# EAGLE design STLink.v21 (EAGLE 7.2.0)
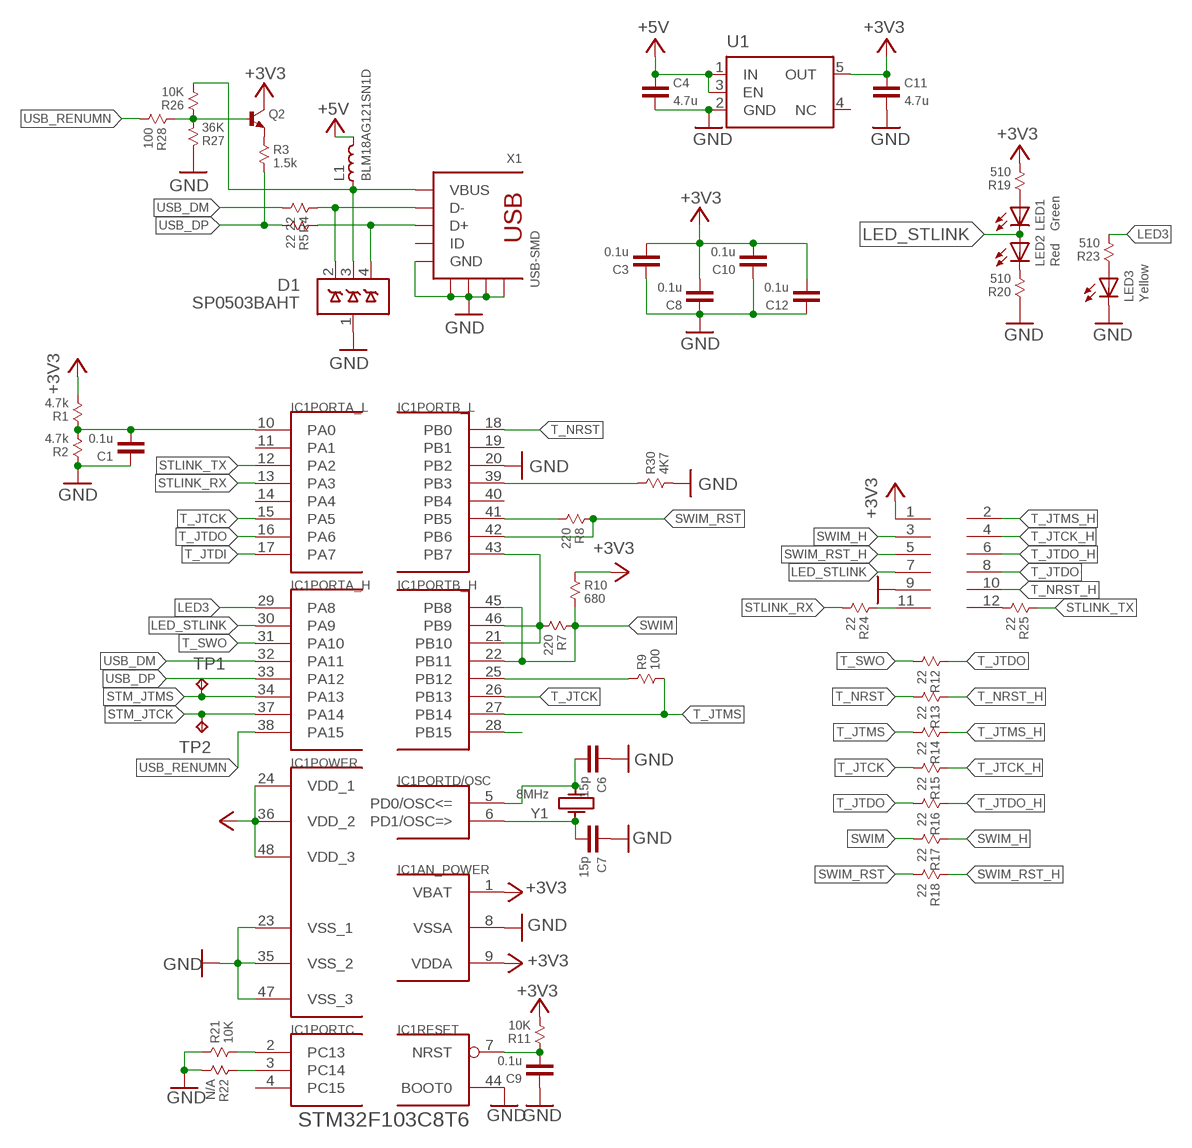
[diagram p0: schematic, sheet 1]

## Parts
C1  0.1u  CAP-0603  [0603]
C3  0.1u  CAP-0603  [0603]
C4  4.7u  CAP-0603  [0603]
C6  15p  CAP-0603  [0603]
C7  15p  CAP-0603  [0603]
C8  0.1u  CAP-0603  [0603]
C9  0.1u  CAP-0603  [0603]
C10  0.1u  CAP-0603  [0603]
C11  4.7u  CAP-0603  [0603]
C12  0.1u  CAP-0603  [0603]
CN2  M06X2  [PLANAR-6X2]
D1  SP0503BAHT  [SOT143]
IC1  STM32F103C8T6  STM32F10XCXT6  [TQFP48]
L1  BLM18AG121SN1D  INDUCTOR-0603  [0603]
LED1  Green  LEDCHIP-LED0603  [CHIP-LED0603]
LED2  Red  LEDCHIP-LED0603  [CHIP-LED0603]
LED3  Yellow  LEDCHIP-LED0603  [CHIP-LED0603]
Q2  NPNBC847  [SOT-23]
R1  4.7k  RESISTOR-0603  [0603]
R2  4.7k  RESISTOR-0603  [0603]
R3  1.5k  RESISTOR-0603  [0603]
R4  22  RESISTOR-0603  [0603]
R5  22  RESISTOR-0603  [0603]
R7  220  RESISTOR-0603  [0603]
R8  220  RESISTOR-0603  [0603]
R9  100  RESISTOR-0603  [0603]
R10  680  RESISTOR-0603  [0603]
R11  10K  RESISTOR-0603  [0603]
R12  22  RESISTOR-0603  [0603]
R13  22  RESISTOR-0603  [0603]
R14  22  RESISTOR-0603  [0603]
R15  22  RESISTOR-0603  [0603]
R16  22  RESISTOR-0603  [0603]
R17  22  RESISTOR-0603  [0603]
R18  22  RESISTOR-0603  [0603]
R19  510  RESISTOR-0603  [0603]
R20  510  RESISTOR-0603  [0603]
R21  10K  RESISTOR-0603  [0603]
R22  N/A  RESISTOR-0603  [0603]
R23  510  RESISTOR-0603  [0603]
R24  22  RESISTOR-0603  [0603]
R25  22  RESISTOR-0603  [0603]
R26  10K  RESISTOR-0603  [0603]
R27  36K  RESISTOR-0603  [0603]
R28  100  RESISTOR-0603  [0603]
R30  4K7  RESISTOR-0603  [0603]
TP1  TPTP10R  [TP10R]
TP2  TPTP10R  [TP10R]
U1  TPS73033  [SOT23-5]
X1  USB-SMD  [USB-MINIB]
Y1  8MHz  CRYSTAL-0532  [C0532]

## Nets
+3V3: C3.1 C8.1 C10.1 C11.2 C12.1 CN2.1 IC1.1(AN_POWER:VBAT) IC1.9(AN_POWER:VDDA) IC1.24(POWER:VDD_1) IC1.36(POWER:VDD_2) IC1.48(POWER:VDD_3) Q2.3(C) R1.2 R10.1 R11.2 R19.2 U1.5(OUT)
+5V: C4.2 L1.2 U1.1(IN) U1.3(EN)
AIN1: C1.1 IC1.10(PORTA_L:PA0) R1.1 R2.2
GND: C1.2 C3.2 C4.1 C6.2 C7.2 C8.2 C9.2 C10.2 C11.1 C12.2 CN2.9 D1.1(GND) IC1.8(AN_POWER:VSSA) IC1.20(PORTB_L:PB2) IC1.23(POWER:VSS_1) IC1.35(POWER:VSS_2) IC1.44(RESET:BOOT0) IC1.47(POWER:VSS_3) LED3.C R2.1 R20.1 R21.1 R22.2 R27.1 R30.2 U1.2(GND) X1.GND X1.GND@1(GND) X1.GND@2(GND) X1.GND@3(GND) X1.GND@4(GND)
LED3: IC1.29(PORTA_H:PA8) R23.2
LED_STLINK: CN2.7 IC1.30(PORTA_H:PA9) LED1.C LED2.A
N$1: C6.1 IC1.5(PORTD/OSC:PD0/OSC<=) Y1.3
N$2: C7.1 IC1.6(PORTD/OSC:PD1/OSC=>) Y1.1
N$3: C9.1 IC1.7(RESET:NRST) R11.1
N$4: IC1.39(PORTB_L:PB3) R30.1
N$5: D1.2(D1) R4.1 X1.D-
N$6: D1.4(D3) R5.1 X1.D+
N$7: LED2.C R20.2
N$8: LED1.A R19.1
N$9: D1.3(D2) L1.1 R26.2 X1.VBUS
N$10: CN2.11 R24.1
N$11: CN2.12 R25.2
N$12: LED3.A R23.1
N$13: Q2.2(E) R3.1
N$14: IC1.28(PORTB_H:PB15)
N$15: IC1.2(PORTC:PC13) R21.2
N$16: IC1.3(PORTC:PC14) R22.1
N$17: Q2.1(B) R26.1 R27.2 R28.1
STLINK_RX: IC1.13(PORTA_L:PA3) R24.2
STLINK_TX: IC1.12(PORTA_L:PA2) R25.1
STM_JTCK: IC1.37(PORTA_H:PA14) TP2.TP
STM_JTMS: IC1.34(PORTA_H:PA13) TP1.TP
SWIM: IC1.22(PORTB_H:PB11) IC1.45(PORTB_H:PB8) R7.1 R10.2 R17.2
SWIM_H: CN2.3 R17.1
SWIM_IN: IC1.21(PORTB_H:PB10) IC1.43(PORTB_L:PB7) IC1.46(PORTB_H:PB9) R7.2
SWIM_RST: IC1.42(PORTB_L:PB6) R8.1 R18.2
SWIM_RST_H: CN2.5 R18.1
SWIM_RST_IN: IC1.41(PORTB_L:PB5) R8.2
T_JTCK: IC1.15(PORTA_L:PA5) IC1.26(PORTB_H:PB13) R15.2
T_JTCK_H: CN2.4 R15.1
T_JTDI: IC1.17(PORTA_L:PA7)
T_JTDO: CN2.8 IC1.16(PORTA_L:PA6) R12.1 R16.2
T_JTDO_H: CN2.6 R16.1
T_JTMS: IC1.27(PORTB_H:PB14) R9.2 R14.2
T_JTMS_H: CN2.2 R14.1
T_NRST: IC1.18(PORTB_L:PB0) R13.2
T_NRST_H: CN2.10 R13.1
T_SWDIO_IN: IC1.25(PORTB_H:PB12) R9.1
T_SWO: IC1.31(PORTA_H:PA10) R12.2
USB_DM: IC1.32(PORTA_H:PA11) R4.2
USB_DP: IC1.33(PORTA_H:PA12) R3.2 R5.2
USB_RENUMN: IC1.38(PORTA_H:PA15) R28.2
Unconnected: IC1.4(PORTC:PC15) IC1.11(PORTA_L:PA1) IC1.14(PORTA_L:PA4) IC1.19(PORTB_L:PB1) IC1.40(PORTB_L:PB4) U1.4(NC) X1.ID

## Library data of the parts
C1 C3 C4 C6-C12 = X893:CAP: Capacitor
CN2 = X893:M06X2
D1 = X893:SP0503BAHT: Surface Mount TVS Avalanche Diode Array (5V) http://www.littelfuse.com/data/en/Data_Sheets/SP05xxBA.pdf
IC1 = stm32:STM32F10XCXT6: ST STM32F101/103 48pin LQFP
L1 = X893:INDUCTOR: http://www.murata.com/products/catalog/pdf/o05e.pdf
LED1-LED3 = led:LED: LED OSRAM: - CHIPLED LG R971, LG N971, LY N971, LG Q971, LY Q971, LO R971, LY R971 LH N974, LH R974 LS Q976, LO Q976, LY Q976 LO Q996 - Hyper CHIPLED LW Q18S LB Q993, LB Q99A, LB R99A - SideLED LS A670, LO A670, LY A670, LG A670, LP A670 LB A673, LV A673, LT A673, LW A673 LH A674 LY A675 LS A676, LA A676, LO A676, LY A676, LW A676 LS A679, LY A679, LG A679 - Hyper Micro SIDELED® LS Y876, LA Y876, LO Y876, LY Y876 LT Y87S - SmartLED LW L88C, LW L88S LB L89C, LB L89S, LG L890 LS L89K, LO L89K, LY L89K LS L896, LA L896, LO L896, LY L896 - TOPLED LS T670, LO T670, LY T670, LG T670, LP T670 LSG T670, LSP T670, LSY T670, LOP T670, LYG T670 LG T671, LOG T671, LSG T671 LB T673, LV T673, LT T673, LW T673 LH T674 LS T676, LA T676, LO T676, LY T676, LB T676, LH T676, LSB T676, LW T676 LB T67C, LV T67C, LT T67C, LS T67K, LO T67K, LY T67K, LW E67C LS E67B, LA E67B, LO E67B, LY E67B, LB E67C, LV E67C, LT E67C LW T67C LS T679, LY T679, LG T679 LS T770, LO T770, LY T770, LG T770, LP T770 LB T773, LV T773, LT T773, LW T773 LH T774 LS E675, LA E675, LY E675, LS T675 LS T776, LA T776, LO T776, LY T776, LB T776 LHGB T686 LT T68C, LB T68C - Hyper Mini TOPLED® LB M676 - Mini TOPLED Santana® LG M470 LS M47K, LO M47K, LY M47K Source: http://www.osram.convergy.de LUXEON: - LUMILED® LXK2-PW12-R00, LXK2-PW12-S00, LXK2-PW14-U00, LXK2-PW14-V00 LXK2-PM12-R00, LXK2-PM12-S00, LXK2-PM14-U00 LXK2-PE12-Q00, LXK2-PE12-R00, LXK2-PE12-S00, LXK2-PE14-T00, LXK2-PE14-U00 LXK2-PB12-K00, LXK2-PB12-L00, LXK2-PB12-M00, LXK2-PB14-N00, LXK2-PB14-P00, LXK2-PB14-Q00 LXK2-PR12-L00, LXK2-PR12-M00, LXK2-PR14-Q00, LXK2-PR14-R00 LXK2-PD12-Q00, LXK2-PD12-R00, LXK2-PD12-S00 LXK2-PH12-R00, LXK2-PH12-S00 LXK2-PL12-P00, LXK2-PL12-Q00, LXK2-PL12-R00 Source: www.luxeon.com KINGBRIGHT: KA-3528ASYC Source: www.kingbright.com
Q2 = X893:NPN
R1-R5 R7-R28 R30 = X893:RESISTOR
TP1 TP2 = testpad:TP: Test pad
U1 = X893:TPS73033: LOW-NOISE, HIGH PSRR, RF 200-mA LOW-DROPOUT LINEAR REGULATOR http://www.terraelectronica.ru/pdf/TI/TPS73033.pdf
X1 = X893:USB: USB Connectors USB-B-PTH is fully proven SKU : PRT-00139 USB-miniB is fully proven SKU : PRT-00587 USB-A-PCB is untested. USB-A-H is throughly reviewed, but untested. Spark Fun Electronics SKU : PRT-00437 USB-B-SMT is throughly reviewed, but untested. Needs silkscreen touching up. USB-A-S has not been used/tested USB-MB-H has not been used/tested
Y1 = X893:CRYSTAL: KX-9A <http://www.kosmodrom.com.ua/pdf/KX-9A.pdf> KX-KT <http://www.kosmodrom.com.ua/pdf/KX-K.pdf>

## Board
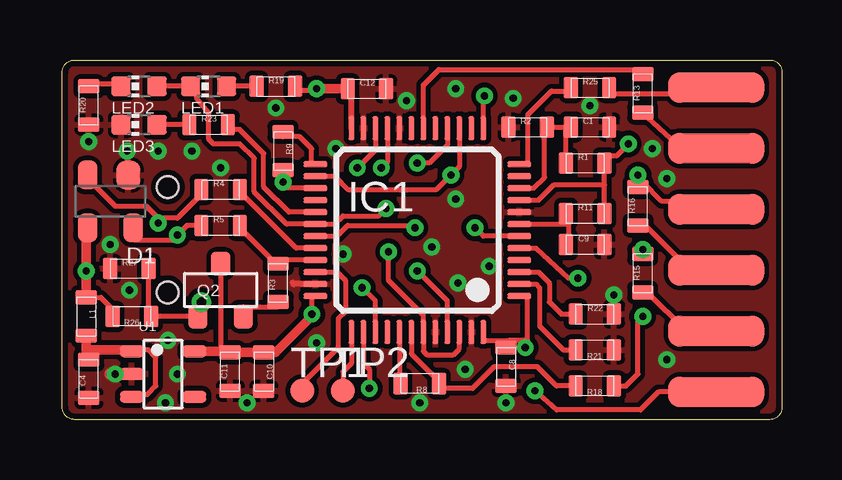
[diagram p1: board, top side]
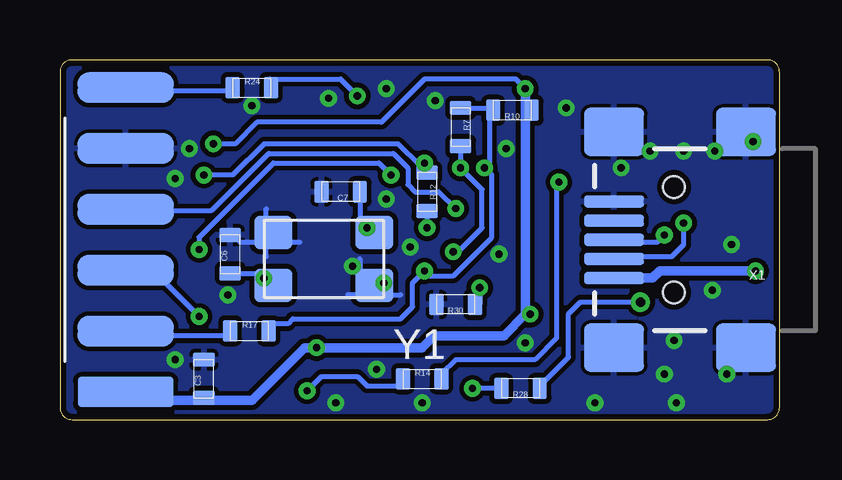
[diagram p2: board, bottom side, seen from below]

Size 30 x 15 mm. Coordinates in mm from the lower left corner, seen from the top.
Outline: 0,0.5 0,14.5 arc-90 0.5,15 29.5,15 arc-90 30,14.5 30,0.5 arc-90 29.5,0 0.5,0 arc-90 0,0.5
Copper layers (1+16): Top 0.018mm / dielectric 0.8mm / Bottom 0.018mm
Design rules "Rezonit-020-015": minimum track width 0.15mm, minimum drill 0.3mm, track to track 0.15mm, track to pad 0.2mm, pad to pad 0.2mm, via to via 0.2mm, smd to smd 0mil, copper to edge 0.25mm, drill to drill 0.3mm, minimum pad ring 0.2mm, minimum via ring 0.2mm, stop-mask expansion 4mil, vias tented up to drill 0.4mm, thermal gap 0.15mm

### Footprints (pad centres in the part's own frame; a part is rotated, then mirrored left to right if it is on the bottom)
0603 = smd 0.6 x 0.9: 1 -0.8,0; 2 0.8,0
PLANAR-6X2 = smd 1.27 x 4: 1 6.35,2.54; 3 3.81,2.54; 5 1.27,2.54; 7 -1.27,2.54; 9 -3.81,2.54; 11 -6.35,2.54 | smd 1.27 x 4 bottom: 2 6.35,2.54; 4 3.81,2.54; 6 1.27,2.54; 8 -1.27,2.54; 10 -3.81,2.54; 12 -6.35,2.54
SOT143 = smd 1 x 1.2: 1 -0.75,-1.1 | smd 0.8 x 1.2: 2 0.95,-1.1; 3 0.95,1.1; 4 -0.95,1.1
TQFP48 = smd 0.25 x 1: 1 -2.75,-4.25; 2 -2.25,-4.25; 3 -1.75,-4.25; 4 -1.25,-4.25; 5 -0.75,-4.25; 6 -0.25,-4.25; 7 0.25,-4.25; 8 0.75,-4.25; 9 1.25,-4.25; 10 1.75,-4.25; 11 2.25,-4.25; 12 2.75,-4.25; 25 2.75,4.25; 26 2.25,4.25; 27 1.75,4.25; 28 1.25,4.25; 29 0.75,4.25; 30 0.25,4.25; 31 -0.25,4.25; 32 -0.75,4.25; 33 -1.25,4.25; 34 -1.75,4.25; 35 -2.25,4.25; 36 -2.75,4.25 | smd 1 x 0.25: 13 4.25,-2.75; 14 4.25,-2.25; 15 4.25,-1.75; 16 4.25,-1.25; 17 4.25,-0.75; 18 4.25,-0.25; 19 4.25,0.25; 20 4.25,0.75; 21 4.25,1.25; 22 4.25,1.75; 23 4.25,2.25; 24 4.25,2.75; 37 -4.25,2.75; 38 -4.25,2.25; 39 -4.25,1.75; 40 -4.25,1.25; 41 -4.25,0.75; 42 -4.25,0.25; 43 -4.25,-0.25; 44 -4.25,-0.75; 45 -4.25,-1.25; 46 -4.25,-1.75; 47 -4.25,-2.25; 48 -4.25,-2.75
CHIP-LED0603 = smd 0.8 x 0.8: A 0,-0.75; C 0,0.75
SOT-23 = smd 0.8 x 1: 1 -0.95,-1.1; 2 0.95,-1.1; 3 0,1.1
TP10R = smd 1 x 1: TP 0,0
SOT23-5 = smd 0.5 x 1: 1 -0.95,-1.3; 2 0,-1.3; 3 0.95,-1.3; 4 0.95,1.3; 5 -0.95,1.3
USB-MINIB = smd 2.5 x 0.5: D+ 2.5,0; D- 2.5,0.8; GND 2.5,-1.6; ID 2.5,-0.8; VBUS 2.5,1.6 | smd 2.5 x 2: GND@1 -3,-4.5; GND@2 -3,4.5; GND@3 2.5,4.5; GND@4 2.5,-4.5 | hole 0.9: 0,2.2; 0,-2.2
C0532 = smd 1.6 x 1.4: 1 -2.1,-1.1; 2 2.1,-1.1; 3 2.1,1.1; 4 -2.1,1.1

### Placement (x,y rotation side)
C1  22,12.2 0 top
C3  24,1.7 90 bottom
C4  1.1,1.7 90 top
C6  22.9,6.9 90 bottom
C7  18.3,9.5 180 bottom
C8  18.5,2.2 270 top
C9  21.8,7.3 0 top
C10  8.4,2 270 top
C11  7,2 90 top
C12  12.7,13.8 0 top
CN2  29.8,7.5 270 bottom
D1  2,9.1 180 top
IC1  14.8,7.9 90 top
L1  1,4.3 270 top
LED1  6.1,13.9 90 top
LED2  3.2,13.9 90 top
LED3  3.2,12.3 90 top
Q2  6.6,5.4 0 top
R1  21.8,10.7 0 top
R2  19.4,12.2 0 top
R3  9,5.7 90 top
R4  6.6,9.6 0 top
R5  6.6,8.1 0 top
R7  13.3,12.2 270 bottom
R8  14.9,1.5 180 top
R9  9.2,11.2 270 top
R10  11.14,12.9 180 bottom
R11  21.8,8.6 0 top
R12  14.7,9.5 270 bottom
R13  24.2,13.6 90 top
R14  14.9,1.7 0 bottom
R15  24.2,6.1 90 top
R16  24,8.9 90 top
R17  22.1,3.7 0 bottom
R18  22.2,1.4 180 top
R19  8.9,13.9 0 top
R20  1.1,13.1 90 top
R21  22.2,2.9 180 top
R22  22.2,4.4 0 top
R23  6.1,12.3 0 top
R24  22,13.85 0 bottom
R25  22,13.85 0 top
R26  2.9,4.3 180 top
R27  2.8,6.3 0 top
R28  10.8,1.3 180 bottom
R30  13.5,4.8 180 bottom
TP1  10,1.2 0 top
TP2  11.7,1.2 0 top
U1  4.2,1.9 270 top
X1  4.4,7.5 180 bottom
Y1  19,6.7 180 bottom

### Tracks (layer width: path | path; a pad name or v marks a point on that pad's centre or on a via)
+3V3  (via drill 0.3)
  Top 0.2: 22.6,8.5 R11.2 22.6,9.8 | 19.3,3.3 19.4,3.3 19.4,5.15 IC1.1 | IC1.48 17.55,3.3 18.6,3.3 | v19.3,3 19.3,3.3 | 19.3,3.3 18.6,3.3 | 18.6,3.3 C8.1 | IC1.9 19.85,9.15 20.5,9.8 22.6,9.8 | 12.05,11.9 IC1.24 | 10.6,5.15 IC1.36 10.4,5.15 v10.4,4.4 | 22.6,9.8 R1.2 | 22.6,10.75 R1.2 | R19.2 9.6,13.75 10.59,13.75 v10.6,13.8 | Q2.3 6.6,2.9 6.65,2.85 | v23.6,11.5 23.1,11 22.6,11 R1.2
  Top 0.25: IC1.24 12.05,13.5 C12.1
  Top 0.4: U1.5 6.65,2.85 6.8,2.85 6.8,2.9 C11.2 C10.1 8.9,2.8 10.4,4.3 v10.4,4.4 | C12.1 v10.6,13.8
  Bottom 0.2: R10.1 10.6,12.9 10.6,13.3 | v10.6,13.8 11,14.2 14.8,14.2 16.6,12.4 21.8,12.4 22.7,11.5 v23.6,11.5
  Bottom 0.4: 10.6,4.4 11.5,3.5 14.4,3.5 14.9,3 v19.3,3 19.8,3 22,0.8 24,0.8 | 10.6,4.4 v10.4,4.4 | CN2.1 26.05,1.15 25.8,0.9 25.8,0.8 24,0.8 | C3.1 24,0.8 | 10.6,4.4 10.6,13.3 v10.6,13.8
+5V
  Top 0.2: U1.3 2.9,1 2.95,1.05 3.55,1.05 3.9,1.4 3.9,2.6 3.6,2.9 3.05,2.9 U1.1
  Top 0.4: L1.2 1,2.9 | 1,2.9 1,2.5 C4.2 | U1.1 2.95,2.85 2.9,2.9 1,2.9
AIN1
  Top 0.2: IC1.10 19.65,9.65 20.1,10.1 20.1,12.15 | 20.1,12.15 R2.2 | R1.1 21,12.2 | 20.1,12.15 20.25,12.15 R2.2 | R2.2 21,12.2 | 21,12.2 C1.1
GND  (via drill 0.3)
  Top 0.25: IC1.35 9.65,5.65 9.6,5.7
  Top 0.5: 2,1.9 2.6,1.9
  Bottom 0.2: 17.5,6.7 17.5,5.2 | 17.5,5.2 15.8,5.2 | 17.5,5.2 18,5.2 | 21.4,6.8 21.4,8.8 | 22.5,7.4 20,7.4
  other vias: 25.2,2.5 11.7,6.9 24.6,11.3 2.7,11.2 2.8,5.4 16.4,9.2 18.5,0.7 16.5,5.7 18.8,13.4 14.35,13.3 16.8,2.1 23,5.2 25.2,10.05 2.2,1.9 7.7,0.7 1.1,11.6 10.6,3.2 4.8,1.9 5.4,11.2 8.9,13 17.8,6.4 15.4,7.2 11.4,11.3 4,11.2 6.6,10.5 2,7.3 14.9,0.7 4.3,0.7 4.4,3.3 16.4,13.8 22,13.1
  pour Top (isolate 0.2): 0.2,0.2 0.2,14.8 29.8,14.8 29.8,0.2
  pour Bottom (isolate 0.2): 0.2,0.2 0.2,14.8 29.8,14.8 29.8,0.2
LED3
  Top 0.2: IC1.29 9.45,8.65 8.4,9.7 8.4,11.1 7.4,12.1 6.95,12.1 R23.2
LED_STLINK  (via drill 0.3)
  Top 0.2: v13.5,8.8 13.2,8.5 11.7,8.5 11.35,8.15 IC1.30 9.35,8.15 8,9.5 8,10.9 7.4,11.5 6.3,11.5 6.1,11.7 6.1,12.8 5.6,13.4 5.6,13.9 LED1.C LED2.A
  Bottom 0.2: v13.5,8.8 14.2,9.5 15.2,9.5 15.5,9.8 15.5,10.5 16.1,11.1 21.3,11.1 23.7,8.7 25.6,8.7 25.67,8.77 CN2.7
N$1  (via drill 0.3)
  Top 0.2: IC1.5 19.75,7.15 21.1,5.9 v21.5,5.9
  Bottom 0.2: C6.1 21.6,6.1 Y1.3 v21.5,5.9
N$2  (via drill 0.3)
  Top 0.2: IC1.6 17.55,7.65 v17.2,8
  Bottom 0.2: v17.2,8 Y1.1 17.5,8 C7.1
N$3
  Top 0.2: IC1.7 21.1,8.15 | 21.1,8.4 R11.1 21.1,8.15 | 21.1,8.15 21.1,7.05 C9.1
N$4  (via drill 0.3)
  Top 0.2: IC1.39 13.05,4.95 v12.5,5.5
  Bottom 0.2: v12.5,5.5 12.5,4.8 R30.1
N$5  (via drill 0.3)
  Top 0.2: R4.1 5.8,9.4 4.8,8.4 4.2,8.4 v4,8.2 4,8.4 3.5,8.9 2.2,8.9 1.05,10.05 D1.2
  Bottom 0.2: X1.D- 6.9,6.8 4.5,6.8 4,7.3 v4,8.2
N$6  (via drill 0.3)
  Top 0.2: R5.1 5.2,8.1 v4.8,7.7 4.6,7.5 3,7.5 2.85,7.65 D1.4
  Bottom 0.2: X1.D+ 6.9,7.4 5.1,7.4 v4.8,7.7
N$7
  Top 0.2: LED2.C 2.4,14 1.1,14 R20.2
N$8
  Top 0.2: R19.1 LED1.A
N$9  (via drill 0.3)
  Top 0.2: L1.1 1.6,5.1 2.2,4.5 2.2,4.35 R26.2
  Top 0.4: D1.3 1.05,7.95 1,7.9 v1,6.2 L1.1
  Bottom 0.4: X1.VBUS 5.3,5.9 5,6.2 v1,6.2
N$10
  Bottom 0.2: 22.6,13.7 R24.1 22.8,13.7 27.11,13.7 CN2.11
N$11
  Top 0.2: R25.2 22.8,13.6 25.7,13.6 25.75,13.85 CN2.12
N$12
  Top 0.2: R23.1 LED3.A
N$13
  Top 0.2: Q2.2 7.55,4.7 9,4.7 R3.1
N$15
  Top 0.2: IC1.2 19.75,5.65 19.9,5.5 19.9,3.9 20.9,2.9 R21.2
N$16
  Top 0.2: IC1.3 19.85,6.15 20.3,5.7 20.3,4.9 20.8,4.4 R22.1
N$17  (via drill 0.4)
  Top 0.2: Q2.1 5.75,4.35 | 5.75,4.35 5.7,4.3 R26.1 3.6,4.3 R27.2 | 5.75,4.35 5.75,4.85 v5.8,4.9
  Bottom 0.2: v5.8,4.9 8.3,4.9 8.8,4.4 8.8,2.6 9.9,1.5 9.9,1.3 R28.1
STLINK_RX  (via drill 0.3)
  Top 0.2: IC1.13 17.55,13.45 v17.6,13.5
  Bottom 0.2: v17.6,13.5 18.3,14.2 21.25,14.2 21.25,13.65 R24.2
STLINK_TX
  Top 0.2: IC1.12 19.4,10.65 19.4,12.7 20.4,13.7 21.2,13.7 R25.1
STM_JTCK
  Top 0.2: IC1.37 12.05,2.35 11.7,2 TP2.TP
STM_JTMS
  Top 0.2: IC1.34 11.45,6.15 11.8,5.8 11.8,4.5 11.5,4.2 11.5,3 10,1.5 TP1.TP
SWIM  (via drill 0.3)
  Top 0.2: IC1.22 13.05,11.25 v12.3,10.5 | IC1.45 16.05,4.95 v14.8,6.2
  Bottom 0.2: R17.2 21.3,4 20.5,4 20.3,4.2 15.8,4.2 15.3,4.7 15.3,5.7 v14.8,6.2 14.8,6 13.6,6 12,7.6 12,10.2 v12.3,10.5 12.1,10.7 12.1,12.9 R10.2 12.14,13 R7.1
SWIM_H
  Bottom 0.2: R17.1 22.8,3.5 26.2,3.5 26.4,3.3 26.59,3.69 CN2.3
SWIM_IN  (via drill 0.3)
  Top 0.2: IC1.21 13.55,10.75 v13.3,10.5 | v13.6,7 13.6,5.8 15.05,4.35 IC1.43 15.05,2.85 15.2,2.7 16.3,2.7 16.55,2.95 IC1.46
  Bottom 0.2: v13.6,7 13.4,7 12.4,8 12.4,9.6 v13.3,10.5 R7.2
SWIM_RST
  Top 0.2: IC1.42 14.55,2.75 15.6,1.7 15.6,1.5 | 15.6,1.45 R8.1 15.6,1.5 | R18.2 20.6,1.4 19.8,2.2 18,2.2 17.1,1.3 15.6,1.3 15.6,1.45 | 15.6,1.45 15.6,1.5
SWIM_RST_H  (via drill 0.3)
  Top 0.2: R18.1 23.5,1.4 24,1.9 24,4.1 v24.2,4.3
  Bottom 0.2: v24.2,4.3 25.8,5.9 26.93,5.9 CN2.5
SWIM_RST_IN
  Top 0.2: IC1.41 14.05,1.5 R8.2
T_JTCK  (via drill 0.3)
  Top 0.2: IC1.15 16.55,10.55 v16.2,10.2 15.6,9.6 11.9,9.6 11.35,10.15 IC1.26 | v24.2,7.1 R15.2
  Bottom 0.2: v24.2,7.1 24.2,7.6 21.1,10.7 16.7,10.7 v16.2,10.2
T_JTCK_H
  Top 0.2: CN2.4 26.01,3.69 24.4,5.3 R15.1
T_JTDO  (via drill 0.3)
  Top 0.2: IC1.16 16.05,11.45 15.3,10.7 v14.8,10.7 | v24,10.2 R16.2 24.25,9.9 24.2,9.9 25,9.1 26.93,9.1 CN2.8
  Bottom 0.2: v24,10.2 22.8,10.2 21.5,11.5 15.9,11.5 15,10.6 v14.8,10.7 14.8,10.3 R12.1
T_JTDO_H
  Top 0.2: R16.1 24.25,8.15 25.7,6.7 26.79,6.7 CN2.6
T_JTMS  (via drill 0.3)
  Top 0.2: IC1.27 9.2,9.65 v9.2,9.9 R9.2
  Bottom 0.2: v9.2,9.9 9.3,9.8 9.3,3.4 10.2,2.5 13.5,2.5 14.1,1.9 R14.2
T_JTMS_H  (via drill 0.3)
  Top 0.2: CN2.2 24.85,1.15 24.1,0.4 20.6,0.4 v19.7,1.2
  Bottom 0.2: v19.7,1.2 19.1,1.8 17.6,1.8 17.2,1.4 15.7,1.4 R14.1
T_NRST
  Top 0.2: IC1.18 15.05,13.95 15.7,14.6 24.2,14.6 R13.2
T_NRST_H
  Top 0.2: CN2.10 27.26,11.5 25.6,11.5 24.4,12.6 R13.1
T_SWDIO_IN
  Top 0.2: IC1.25 10.4,10.65 10.4,11.3 9.9,11.8 9.2,11.8 R9.1
T_SWO  (via drill 0.3)
  Top 0.2: IC1.31 11.45,7.65 11.9,8.1 14.6,8.1 v14.7,8
  Bottom 0.2: R12.2 v14.7,8
USB_DM
  Top 0.2: IC1.32 9.75,7.15 7.5,9.4 7.4,9.45 R4.2
USB_DP
  Top 0.2: IC1.33 9,6.65 | 9,6.65 8.75,6.65 7.5,7.9 7.4,8 R5.2 | R3.2 9,6.65
USB_RENUMN  (via drill 0.3)
  Top 0.2: IC1.38 12.55,2.35 12.8,2.1 v12.8,1.3
  Bottom 0.2: R28.2 v12.8,1.3

### Text on the board
Reference: TOP | BOTTOM | STLINK_TX | STLINK_RX | T_NRST_H | GND | T_JTDO | LED_STLINK | T_JTDO_H | SWIM_RST_H | T_JTCK_H | SWIM_H | T_JTMS_H | +3V3 | STM_JTMS | STM_JTCK